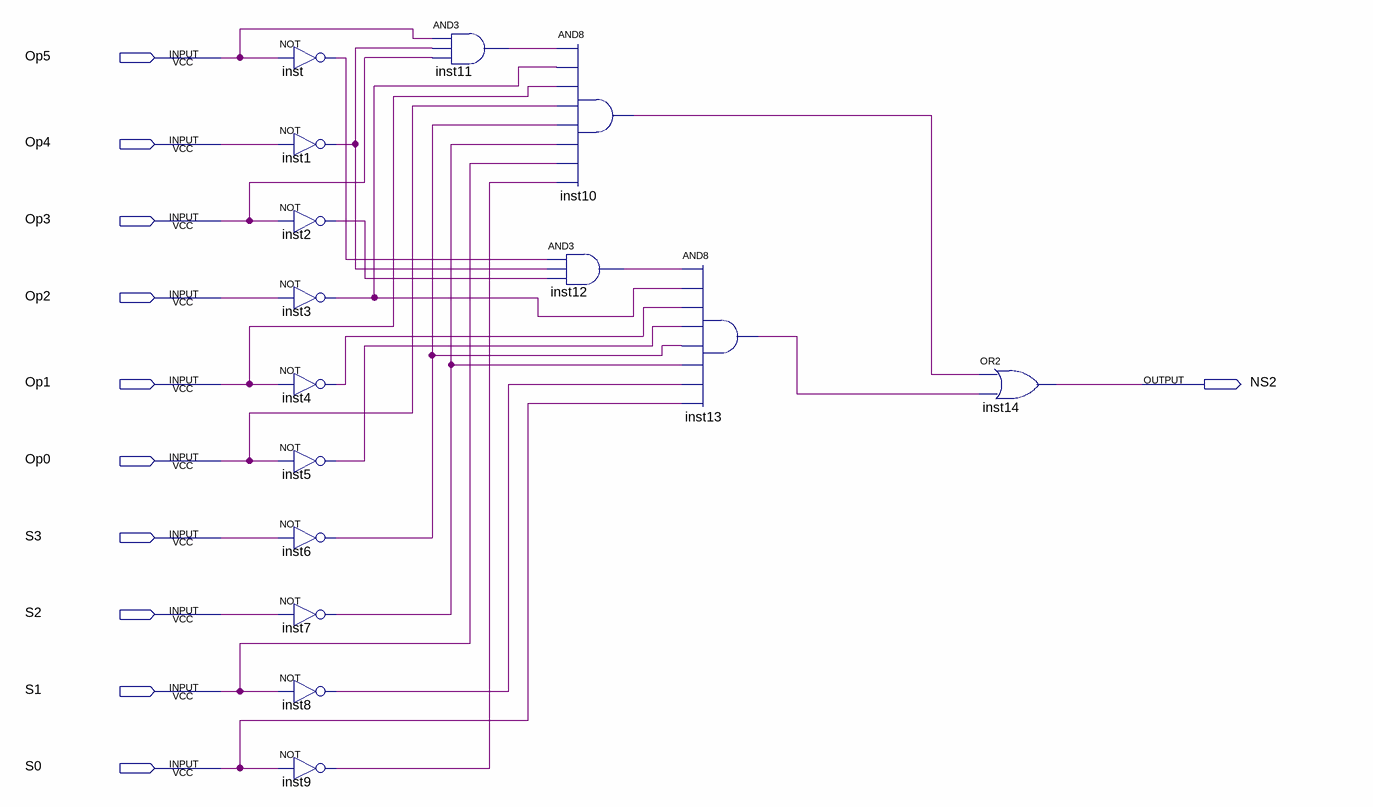
[diagram p0: schematic sheet]
// Quartus schematic NS2.bdf as structural Verilog: 15 symbols, 11 pins
module NS2 (
  input  Op5,
  input  Op4,
  input  Op3,
  input  Op2,
  input  Op1,
  input  Op0,
  input  S3,
  input  S2,
  input  S1,
  input  S0,
  output NS2
);

  wire inst1_out, inst2_out, inst3_out, inst4_out, inst5_out, inst6_out, inst7_out, inst8_out, inst9_out,
       inst10_out, inst11_out, inst12_out, inst13_out, inst_out;

  not inst (inst_out, Op5);
  not inst1 (inst1_out, Op4);
  not inst2 (inst2_out, Op3);
  not inst3 (inst3_out, Op2);
  not inst4 (inst4_out, Op1);
  not inst5 (inst5_out, Op0);
  not inst6 (inst6_out, S3);
  not inst7 (inst7_out, S2);
  not inst8 (inst8_out, S1);
  not inst9 (inst9_out, S0);
  and inst11 (inst11_out, Op5, inst1_out, Op3);
  and inst10 (inst10_out, inst11_out, inst3_out, Op1, Op0, inst6_out, inst7_out, S1, inst9_out);
  and inst12 (inst12_out, inst_out, inst1_out, inst2_out);
  and inst13 (inst13_out, inst12_out, inst3_out, inst4_out, inst5_out, inst6_out, inst7_out, inst8_out, S0);
  or inst14 (NS2, inst10_out, inst13_out);
endmodule
